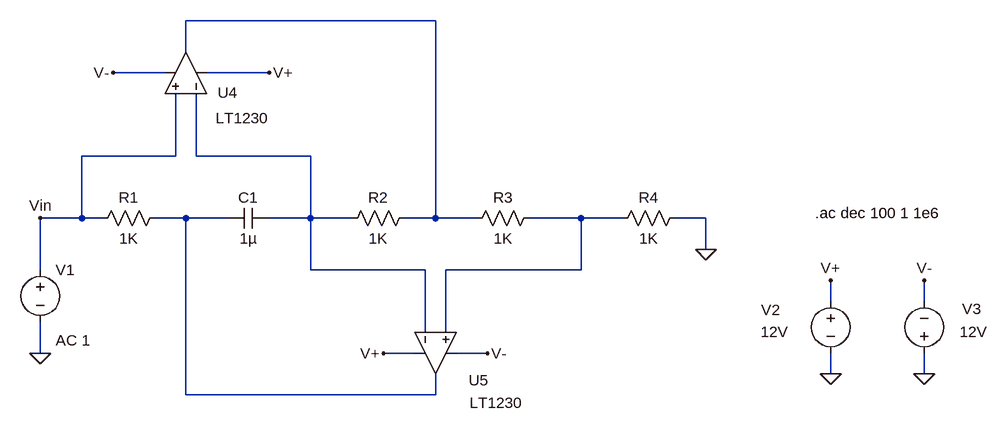
[diagram p0: schematic EJ5_GIC_CtoL_Real.asc]
EJ5_GIC_CtoL_Real.asc, the LTspice schematic file:
Version 4
SHEET 1 2020 680
WIRE 384 -176 0 -176
WIRE 0 -128 0 -176
WIRE -32 -96 -112 -96
WIRE 128 -96 32 -96
WIRE -16 32 -16 -64
WIRE -16 32 -160 32
WIRE 16 32 16 -64
WIRE 192 32 16 32
WIRE -160 128 -160 32
WIRE -160 128 -224 128
WIRE -128 128 -160 128
WIRE 0 128 -48 128
WIRE 64 128 0 128
WIRE 192 128 192 32
WIRE 192 128 128 128
WIRE 256 128 192 128
WIRE 384 128 384 -176
WIRE 384 128 336 128
WIRE 448 128 384 128
WIRE 608 128 528 128
WIRE 672 128 608 128
WIRE 800 128 752 128
WIRE 800 176 800 128
WIRE -224 208 -224 128
WIRE 192 208 192 128
WIRE 368 208 192 208
WIRE 608 208 608 128
WIRE 608 208 400 208
WIRE 992 256 992 224
WIRE 1136 256 1136 224
WIRE 368 304 368 208
WIRE 400 304 400 208
WIRE -224 336 -224 288
WIRE 352 336 304 336
WIRE 464 336 416 336
WIRE 992 368 992 336
WIRE 1136 368 1136 336
WIRE 0 400 0 128
WIRE 384 400 384 368
WIRE 384 400 0 400
FLAG 800 176 0
FLAG -224 336 0
FLAG 992 368 0
FLAG 1136 368 0
FLAG 992 224 V+
FLAG 128 -96 V+
FLAG 304 336 V+
FLAG 1136 224 V-
FLAG 464 336 V-
FLAG -112 -96 V-
FLAG -224 128 Vin
SYMBOL res -32 112 R90
WINDOW 0 0 56 VBottom 2
WINDOW 3 32 56 VTop 2
SYMATTR InstName R1
SYMATTR Value 1K
SYMBOL cap 128 112 R90
WINDOW 0 0 32 VBottom 2
WINDOW 3 32 32 VTop 2
SYMATTR InstName C1
SYMATTR Value 1µ
SYMBOL res 352 112 R90
WINDOW 0 0 56 VBottom 2
WINDOW 3 32 56 VTop 2
SYMATTR InstName R2
SYMATTR Value 1K
SYMBOL res 544 112 R90
WINDOW 0 0 56 VBottom 2
WINDOW 3 32 56 VTop 2
SYMATTR InstName R3
SYMATTR Value 1K
SYMBOL res 768 112 R90
WINDOW 0 0 56 VBottom 2
WINDOW 3 32 56 VTop 2
SYMATTR InstName R4
SYMATTR Value 1K
SYMBOL voltage -224 192 R0
WINDOW 123 24 124 Left 2
WINDOW 39 0 0 Left 0
SYMATTR InstName V1
SYMATTR Value ""
SYMATTR Value2 AC 1
SYMBOL voltage 992 240 R0
WINDOW 0 -107 29 Left 2
WINDOW 3 -108 63 Left 2
WINDOW 123 0 0 Left 0
WINDOW 39 0 0 Left 0
SYMATTR InstName V2
SYMATTR Value 12V
SYMBOL voltage 1136 352 R180
WINDOW 0 -88 84 Left 2
WINDOW 3 -97 49 Left 2
WINDOW 123 0 0 Left 0
WINDOW 39 0 0 Left 0
SYMATTR InstName V3
SYMATTR Value 12V
SYMBOL OpAmps\\LT1230 64 -96 M270
WINDOW 0 -31 15 VLeft 2
WINDOW 3 -70 18 VLeft 2
SYMATTR InstName U4
SYMBOL OpAmps\\LT1230 320 336 M90
WINDOW 0 42 146 VLeft 2
WINDOW 3 76 199 VLeft 2
SYMATTR InstName U5
TEXT 968 120 Left 2 !.ac dec 100 1 1e6

The netlist it stands for:
* EJ5_GIC_CtoL_Real.asc
R1 N003 Vin 1K
C1 N002 N003 1µ
R2 N001 N002 1K
R3 N004 N001 1K
R4 0 N004 1K
V1 Vin 0 AC 1
V2 V+ 0 12V
V3 0 V- 12V
XU4 Vin N002 V+ V- N001 LT1230  ; pins In+ In- V+ V- OUT
XU5 N004 N002 V+ V- N003 LT1230  ; pins In+ In- V+ V- OUT
.ac dec 100 1 1e6
.backanno
.end